# EAGLE schematic FlexSensor and Servo (EAGLE 9.1.1)
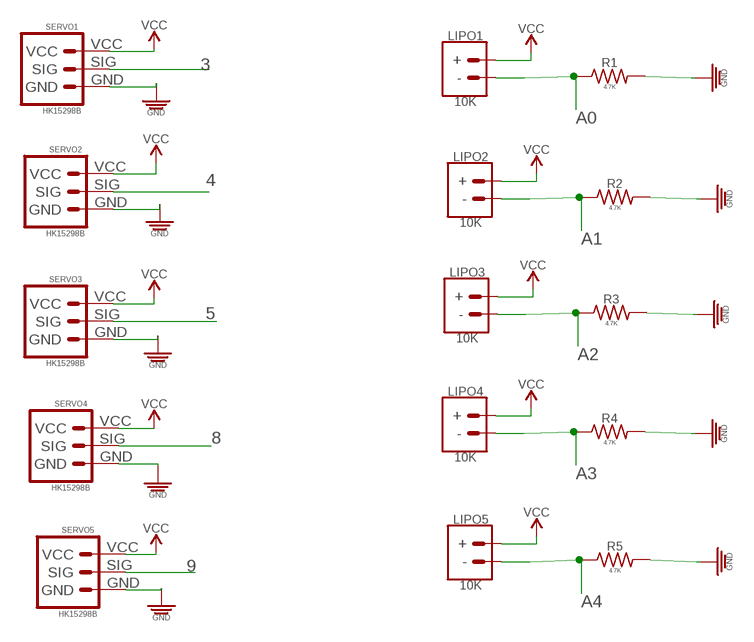
[diagram p0: schematic, sheet 1]

## Parts
LIPO1  10K  FLEX_SENSOR_89400_VERT-MALE_PITCH-2MM  [_MOLEX-89400_VERT_PITCH-2MM]
LIPO2  10K  FLEX_SENSOR_89400_VERT-MALE_PITCH-2MM  [_MOLEX-89400_VERT_PITCH-2MM]
LIPO3  10K  FLEX_SENSOR_89400_VERT-MALE_PITCH-2MM  [_MOLEX-89400_VERT_PITCH-2MM]
LIPO4  10K  FLEX_SENSOR_89400_VERT-MALE_PITCH-2MM  [_MOLEX-89400_VERT_PITCH-2MM]
LIPO5  10K  FLEX_SENSOR_89400_VERT-MALE_PITCH-2MM  [_MOLEX-89400_VERT_PITCH-2MM]
R1  4.7K  4.7KΩ_SMD-0805_1/8W-5%  [RESISTOR_SMD-805]
R2  4.7K  4.7KΩ_SMD-0805_1/8W-5%  [RESISTOR_SMD-805]
R3  4.7K  4.7KΩ_SMD-0805_1/8W-5%  [RESISTOR_SMD-805]
R4  4.7K  4.7KΩ_SMD-0805_1/8W-5%  [RESISTOR_SMD-805]
R5  4.7K  4.7KΩ_SMD-0805_1/8W-5%  [RESISTOR_SMD-805]
SERVO1  HK15298B  SERVO_SERVO-PN  [1X03-VERT-MALE]
SERVO2  HK15298B  SERVO_SERVO-PN  [1X03-VERT-MALE]
SERVO3  HK15298B  SERVO_SERVO-PN  [1X03-VERT-MALE]
SERVO4  HK15298B  SERVO_SERVO-PN  [1X03-VERT-MALE]
SERVO5  HK15298B  SERVO_SERVO-PN  [1X03-VERT-MALE]

## Nets
3: SERVO1.SIG
4: SERVO2.SIG
5: SERVO3.SIG
8: SERVO4.SIG
9: SERVO5.SIG
A0: LIPO1.2(-) R1.1
A1: LIPO2.2(-) R2.1
A2: LIPO3.2(-) R3.1
A3: LIPO4.2(-) R4.1
A4: LIPO5.2(-) R5.1
GND: R1.2 R2.2 R3.2 R4.2 R5.2 SERVO1.GND SERVO2.GND SERVO3.GND SERVO4.GND SERVO5.GND
VCC: LIPO1.1(+) LIPO2.1(+) LIPO3.1(+) LIPO4.1(+) LIPO5.1(+) SERVO1.VCC SERVO2.VCC SERVO3.VCC SERVO4.VCC SERVO5.VCC

## Library data of the parts
LIPO1-LIPO5 = PiB_sensors:FLEX_SENSOR; DATASHEET: http://www.spectrasymbol.com/wp-content/uploads/2016/12/FLEX-SENSOR-DATA-SHEET-v2014-Rev-A.pdf; DATASHEET_CONNECTOR1: https://www.molex.com/pdm_docs/sd/894000220_sd.pdf; DATASHEET_CONNECTOR2: https://www.molex.com/pdm_docs/sd/873690200_sd.pdf; DATASHEET_CRIMP: https://www.molex.com/pdm_docs/sd/502128000_sd.pdf; DIST: Sparkfun; DISTLINK: https://www.sparkfun.com/products/8606; DISTLINK_CONNECTOR1: https://www.digikey.com/products/en?keywords=WM4340-ND; DISTLINK_CONNECTOR2: https://www.digikey.com/products/en?keywords=WM10118-ND; DISTLINK_CRIMP: https://www.digikey.com/products/en?keywords=WM4561CT-ND; DISTPN: SEN-08606; DISTPN_CONNECTOR1: WM4340-ND; DISTPN_CONNECTOR2: WM10118-ND; DISTPN_CRIMP: WM4561CT-ND; DIST_CONNECTOR1: Digikey; DIST_CONNECTOR2: Digikey; DIST_CRIMP: Digikey; MFR: Spectra Symbol; MFR_CONNECTOR1: Molex, LLC; MFR_CONNECTOR2: Molex, LLC; MFR_CRIMP: Molex, LLC; MPN: FS-L-0095-103-ST; MPN_CONNECTOR1: 0894000220; MPN_CONNECTOR2: 0873690200; MPN_CRIMP: 50212-8000
R1-R5 = PiB_resistors:4.7KΩ; CREATOR: MrSwirlyEyes; DATASHEET: http://www.yageo.com/documents/recent/PYu-RC_Group_51_RoHS_L_7.pdf; DIST: Digikey; DISTLINK: https://www.digikey.com/products/en?keywords=311-4.7KARCT-ND; DISTPN: 311-4.7KARCT-ND; MFR: Yageo; MPN: RC0805JR-074K7L
SERVO1-SERVO5 = PiB_motors:SERVO; DATASHEET: https://hobbyking.com/en_us/hobbykingtm-coreless-digital-hv-mg-bb-servo-20kg-0-16sec-66g.html?___store=en_us; DATASHEET_CONNECTOR: http://www.sullinscorp.com/drawings/77____C___S___N-OMIT,_M500,_STRAIGHT,_C10436.pdf; DIST: HobbyKing; DISTLINK: https://hobbyking.com/en_us/hobbykingtm-coreless-digital-hv-mg-bb-servo-20kg-0-16sec-66g.html?___store=en_us; DISTLINK_CONNECTOR: https://www.digikey.com/products/en?keywords=S1012E-03-ND; DISTPN: HK15298B; DISTPN_CONNECTOR: S1012E-03-ND; DIST_CONNECTOR: Digikey; MFR: HobbyKing; MFR_CONNECTOR: Sullins Connector Solutions; MPN: HK15298B; MPN_CONNECTOR: PEC03SAAN